# Altium schematic sheet Device.SchDoc
size A4
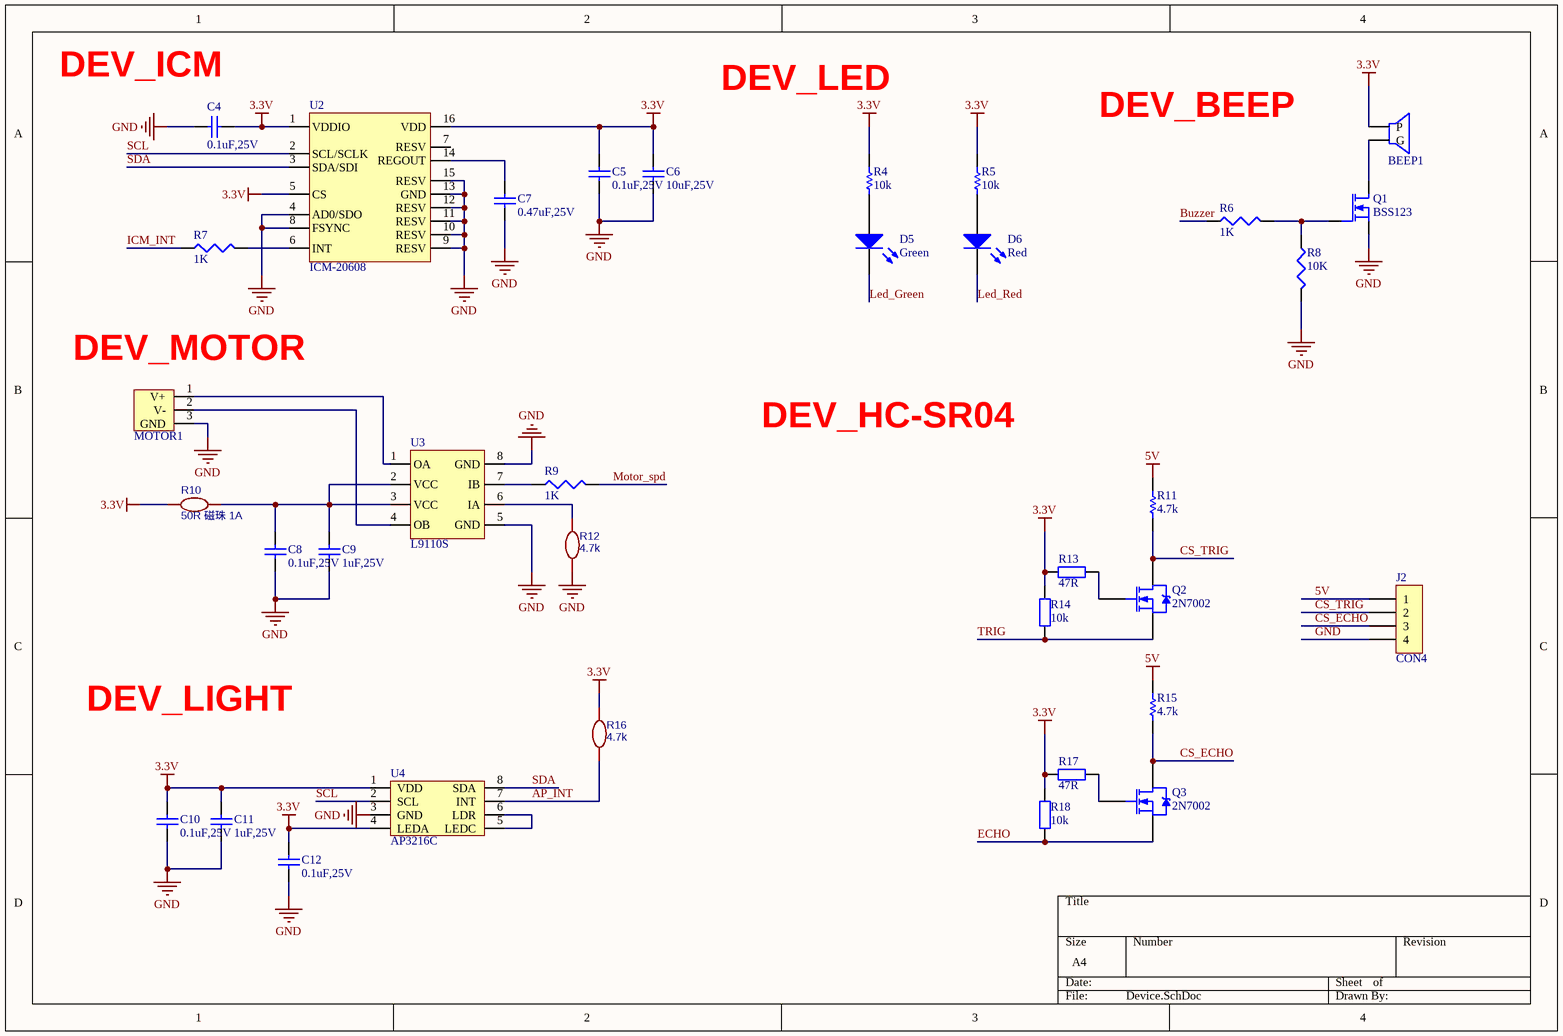
[diagram p0: Device.SchDoc]

## Parts
BEEP1  BEEP  [BEEP]  (value not drawn)
C4  value 0.1uF,25V  [0402_C]  (hidden comment: Cap)
C5  value 0.1uF,25V  [0402_C]  (hidden comment: Cap)
C6  value 10uF,25V  [0402_C]  (hidden comment: Cap)
C7  value 0.47uF,25V  [0402_C]  (hidden comment: Cap)
C8  value 0.1uF,25V  [0402_C]  (hidden comment: Cap)
C9  value 1uF,25V  [0402_C]  (hidden comment: Cap)
C10  value 0.1uF,25V  [0402_C]  (hidden comment: Cap)
C11  value 1uF,25V  [0402_C]  (hidden comment: Cap)
C12  value 0.1uF,25V  [0402_C]  (hidden comment: Cap)
D5  value Green  [0603_LED]  (hidden comment: LED)
D6  value Red  [0603_LED]  (hidden comment: LED)
J2  CON4
MOTOR1  Motor-SMD  [MOTOR-SMD]  (value not drawn)
Q1  BSS123  [SOT-23]
Q2  value 2N7002  [SOT-23!!!]  (hidden comment: NMOS)
Q3  value 2N7002  [SOT-23!!!]  (hidden comment: NMOS)
R4  value 10k  [0603_R]  (hidden comment: Res_5%)
R5  value 10k  [0603_R]  (hidden comment: Res_5%)
R6  1K  [0603_R]
R7  1K  [0603_R]
R8  10K  [0603_R]
R9  1K  [0603_R]
R10  50R 磁珠 1A  [0402_R]
R11  value 4.7k  [0603_R]  (hidden comment: Res_5%)
R12  4.7k  [0402_R]
R13  47R  [0603_R]
R14  value 10k  [0603_R]  (hidden comment: Res)
R15  value 4.7k  [0603_R]  (hidden comment: Res_5%)
R16  4.7k  [0402_R]
R17  47R  [0603_R]
R18  value 10k  [0603_R]  (hidden comment: Res)
U2  ICM-20608  [LGA-16-3*3*0.75]
U3  L9110S  [SOP-8]
U4  AP3216C  [QFN-8-2.4*4.1]

## Nets
3.3V: BEEP1.1(P) C4.1 C5.1 C6.1 C10.1 C11.1 C12.1 R4.2 R5.2 R10.2 R13.1 R14.2 R16.1 R17.1 R18.2 U2.1(VDDIO) U2.5(CS) U2.16(VDD) U4.1(VDD) U4.4(LEDA)
5V: J2.1 R11.2 R15.2
GND: C4.2 C5.2 C6.2 C7.2 C8.2 C9.2 C10.2 C11.2 C12.2 J2.4 MOTOR1.3(GND) Q1.S R8.2 R12.2 U2.4(AD0/SDO) U2.8(FSYNC) U2.9(RESV) U2.10(RESV) U2.11(RESV) U2.12(RESV) U2.13(GND) U2.15(RESV) U3.5(GND) U3.8(GND) U4.3(GND)
AP_INT: R16.2 U4.7(INT)
Buzzer: R6.1
CS_ECHO: J2.3 Q3.2(D) R15.1
CS_TRIG: J2.2 Q2.2(D) R11.1
ECHO: Q3.3(S) R18.1
ICM_INT: R7.1
Led_Green: D5.2(K)
Led_Red: D6.2(K)
Motor_spd: R9.2
SCL: U2.2(SCL/SCLK) U4.2(SCL)
SDA: U2.3(SDA/SDI) U4.8(SDA)
TRIG: Q2.3(S) R14.1
NetBEEP1_2: BEEP1.2(G) Q1.D
NetC7_1: C7.1 U2.14(REGOUT)
NetC8_1: C8.1 C9.1 R10.1 U3.2(VCC) U3.3(VCC)
NetD5_1: D5.1(A) R4.1
NetD6_1: D6.1(A) R5.1
NetMOTOR1_1: MOTOR1.1(V+) U3.1(OA)
NetMOTOR1_2: MOTOR1.2(V-) U3.4(OB)
NetQ1_G: Q1.G R6.2 R8.1
NetQ2_1: Q2.1(G) R13.2
NetQ3_1: Q3.1(G) R17.2
NetR7_2: R7.2 U2.6(INT)
NetR9_1: R9.1 U3.7(IB)
NetR12_1: R12.1 U3.6(IA)
NetU4_5: U4.5(LEDC) U4.6(LDR)

Not connected (* = marked no-connect by the designer): U2 7(RESV)

## Notes on the sheet
- (near C4) DEV_ICM
- DEV_LED
- DEV_BEEP
- (near MOTOR1) DEV_MOTOR
- DEV_HC-SR04
- DEV_LIGHT

## Library data of the parts
BEEP1 = BEEP: 3.3V有源蜂鸣器
C4-C12 = T_Cap_0603_0.1uF_25V_X5R: 贴片电容; Part Typer: X5R; Solder: SMD; Withstand Voltage: 25V; Tolerance: 10%; Schematic Path: X:\Database\Schematic Library.Schlib; Part Number: T_Cap_0603_0.1uF_25V_X5R; LibRef: T_Cap_0603_0.1uF_25V_X5R
D5 D6 = T_LED_Red_0805: 红色LED灯; Solder: SMD; Schematic Path: X:\Database\Schematic Library.Schlib; Part Number: T_LED_Red_0805; LibRef: T_LED_Red_0805
J2 = CON4: Connector
MOTOR1 = Motor-SMD: 电机,SMD
Q1 = BSS123: Mosfet, N-channel, Vds:100V, Id:0.15A, Vgs-th:2.8V, Rds-on:3.5ohm; Brand: NXP; Drain Current: 0.15A; Drain Source Voltage: 100V; Gate Source Voltage: 20V; On Resistance: 3.5ohm; Threshold Voltage: 2.8V; Brand Number: BSS123; Case Style: SOT-23; Order Code Supplier: 1510764; Price: 0,082; Supplier: Farnell; Temperature Range: -55°C to +150°C; Transistor Polarity: N-channel
Q2 Q3 = T_2N7002: Solder: SMD; Vds: 60 V; Id: 0.115 A; Rds: 1.1 Ohms; Schematic Path: X:\Database\Schematic Library.Schlib; Part Number: T_2N7002; LibRef: T_2N7002; ComponentLink2Description: Datasheet
R4 R5 = T_Res_0603_10k_5%_1/10W: 贴片电阻; Solder: SMD; Power: 1/10W; Tolerance: 5%; Schematic Path: X:\Database\Schematic Library.Schlib; Part Number: T_Res_0603_10k_5%_1/10W; LibRef: T_Res_0603_10k_5%_1/10W
R6-R9 = 1.5k/0402/0063W/50V: Resistor, 1.5k, 0.1%, 0.0625W, 50V, 100PPM, 0402; Brand: VISHAY DRALORIC; Brand Number: CRCW04021K50FKED; Case Style: 0402; Power Rating: 0.063W; Order Code Supplier: 2121624; Price: 0,0054; Resistance: 1.5k; Supplier: Farnell; Temperature Coefficient: ± 100PPM; Temperature Range: -55°C to +125°C; Voltage Rating: 50V
R10 R12 R16 = 100k: nameAlias: Value(Ω); Contributor: LCEDA_Lib; spicePre: R; spiceSymbolName: R_0603_EU
R11 R15 = T_Res_0603_4.3k_5%_1/10W: 贴片电阻; Solder: SMD; Power: 1/10W; Tolerance: 5%; Schematic Path: X:\Database\Schematic Library.Schlib; Part Number: T_Res_0603_4.3k_5%_1/10W; LibRef: T_Res_0603_4.3k_5%_1/10W
R13 R17 = Res
R14 R18 = T_Res_0603_10k_1%_1/10W: 贴片电阻; Solder: SMD; Power: 1/10W; Tolerance: 1%; Schematic Path: X:\Database\Schematic Library.Schlib; Part Number: T_Res_0603_10k_1%_1/10W; LibRef: T_Res_0603_10k_1%_1/10W
U2 = U-ICM-20608: 三轴陀螺仪/三轴加速度计,
U3 = U-L9110S: 电机驱动,800mA
U4 = U-AP3216C: Sensor.光照/距离